# Altium schematic sheet 05_POWER_SAMA7.Doc.SchDoc
size 420 x 297 mm; SheetNumber: 7; SheetTotal: 29
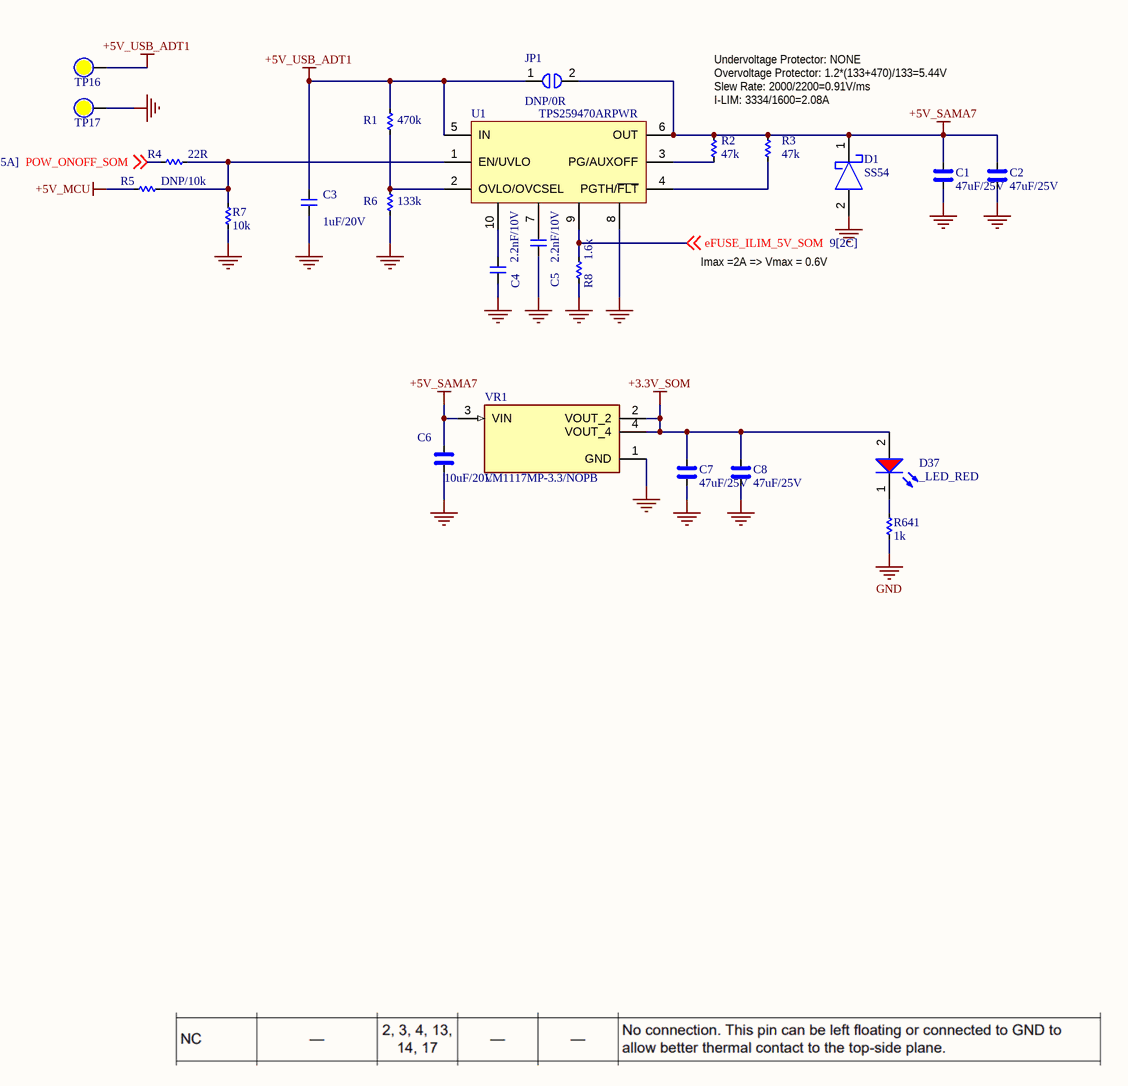
[diagram p0: 05_POWER_SAMA7.Doc.SchDoc]

## Parts
C1  47uF/25V  [CAP_C_3225X80]
C2  47uF/25V  [CAP_C_3225X80]
C3  1uF/20V  [CAP_C_1005X60]
C4  2.2nF/10V  [CAP_C_1005X60]
C5  2.2nF/10V  [CAP_C_1005X60]
C6  10uF/20V  [CAP_C_2012X110]
C7  47uF/25V  [CAP_C_3225X80]
C8  47uF/25V  [CAP_C_3225X80]
D1  SS54  [DO-214AC_SMA]
D37  _LED_RED  [LED_0603]
JP1  DNP/0R  [RES_C_1608X60]
R1  470k  [RES_C_1005X40]
R2  47k  [RES_C_1005X40]
R3  47k  [RES_C_1005X40]
R4  22R  [RES_C_1005X40]
R5  DNP/10k  [RES_C_1005X40]
R6  133k  [RES_C_1005X40]
R7  10k  [RES_C_1005X40]
R8  1.6k  [RES_C_1005X40]
R641  1k  [RES_C_1005X40]
TP16  (no value)  [Testpoint_TH_D130H80]  (no BOM)
TP17  (no value)  [Testpoint_TH_D130H80]  (no BOM)
U1  TPS259470ARPWR  [VQFN-HR-10]
VR1  LM1117MP-3.3/NOPB  [VREG_LM1117MP-3.3/NOPB]

## Nets
+3.3V_SOM: C7.2 C8.2 D37.2(A) VR1.2(VOUT_2) VR1.4(VOUT_4)
+5V_MCU: R5.2
+5V_SAMA7: C1.2 C2.2 C6.1 D1.1 JP1.2 R2.2 R3.2 U1.6(OUT) VR1.3(VIN)
+5V_USB_ADT1: C3.2 JP1.1 R1.2 TP16.1 U1.5(IN)
GND: C1.1 C2.1 C3.1 C4.1 C5.1 C6.2 C7.1 C8.1 D1.2 R6.1 R7.2 R8.1 R641.1 TP17.1 U1.8 VR1.1(GND)
eFUSE_ILIM_5V_SOM: R8.2 U1.9 ; off-sheet eFUSE_ILIM_5V_SOM
POW_ONOFF_SOM: R4.2 ; off-sheet POW_ONOFF_SOM
NetC4_2: C4.2 U1.10
NetC5_2: C5.2 U1.7
NetD37_1: D37.1(K) R641.2
NetR1_1: R1.1 R6.2 U1.2(OVLO/OVCSEL)
NetR2_1: R2.1 U1.3(PG/AUXOFF)
NetR3_1: R3.1 U1.4(PGTH/~{FLT})
NetR4_1: R4.1 R5.1 R7.1 U1.1(EN/UVLO)

## Notes on the sheet
- Undervoltage Protector: NONE
- Overvoltage Protector: 1.2*(133+470)/133=5.44V
- Slew Rate: 2000/2200=0.91V/ms
- I-LIM: 3334/1600=2.08A
- Imax =2A => Vmax = 0.6V
- Project:
- Sub-system:
- Design by:
- Sheet title:
- Sheet
- of
- Checked by:
- Approved by:
- Revision:
- Document No:
- Size:
- Date:
- A3

## Library data of the parts
C1 C2 C6-C8 = _CAP_C_High_2: CAP CHIP High Value
C3-C5 = _CAP_C_2: CAP CHIP
D1 = SS54: DIODE SCHOTTKY 60V 3A DO214AA
JP1 = JUMPER_1_1
R1-R8 R641 = _RES_B_2: RES
TP16 TP17 = Test Point: Solder: NF
VR1 = LM1117MP-3.3/NOPB: 800-mA 15-V linear voltage regulator; MF: Texas Instruments; SnapEDA_Link: https://www.snapeda.com/parts/LM1117MP-3.3/NOPB/Texas+Instruments/view-part/?ref=snap; Package: SOT-223-4 Texas Instruments; Value: *; MP: LM1117MP-3.3/NOPB; Check_prices: https://www.snapeda.com/parts/LM1117MP-3.3/NOPB/Texas+Instruments/view-part/?ref=eda